# Altium schematic sheet NUCLEO.SchDoc
size A; SheetNumber: 1; SheetTotal: 4
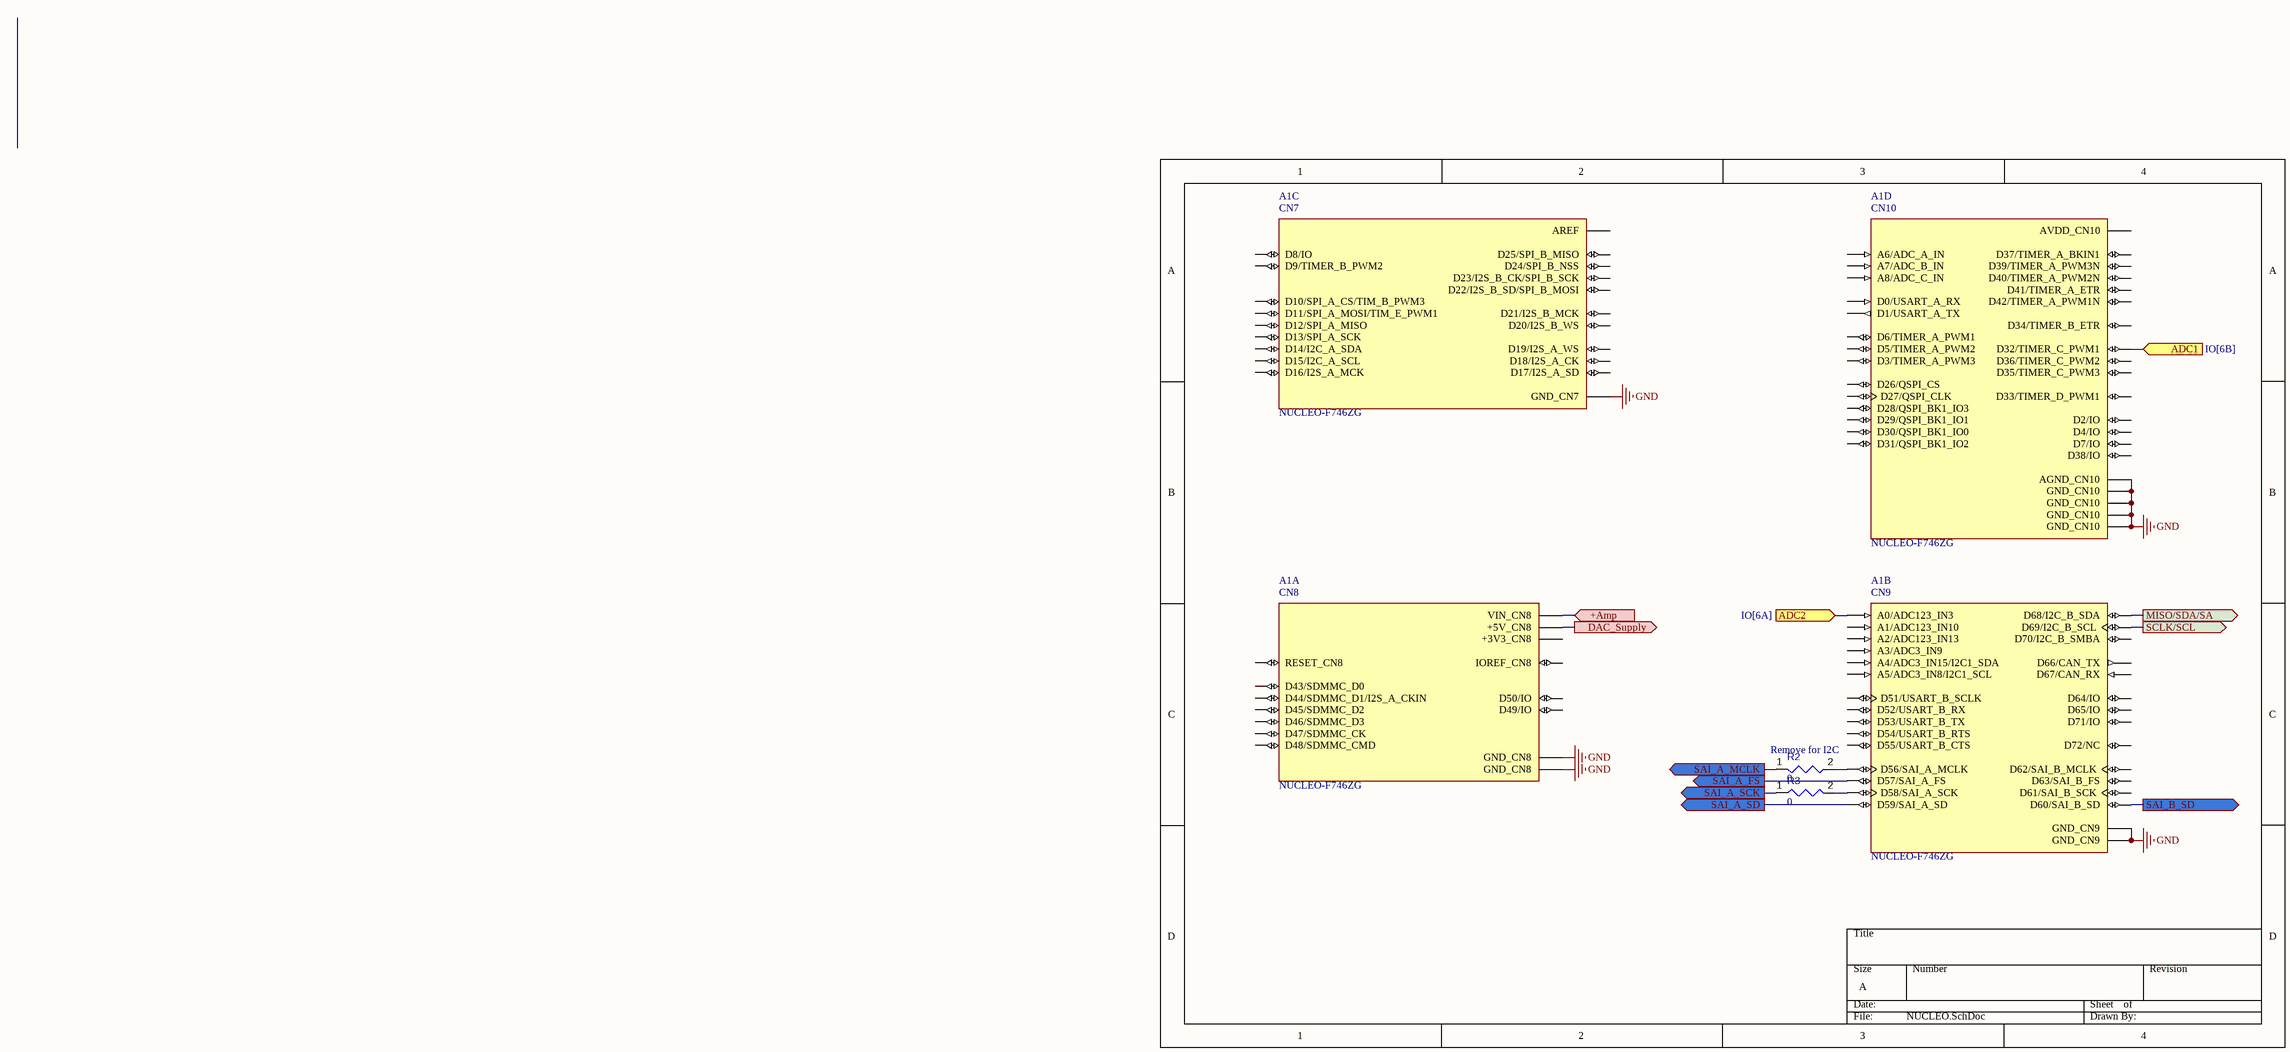
[diagram p0: NUCLEO.SchDoc]

## Parts
A1  NUCLEO-F746ZG  [MODULE_NUCLEO-F746ZG]  (parts A,B,C,D of 4)
R2  value 0  [RESC0603(1608)_L]  (hidden comment: 0Ohm 0603)
R3  0  [RESC0603(1608)_L]

## Ports
+Amp (in, see Amps[1A], Amps[1B], Amps[1C], Amps[1D], Amps[2A], Amps[2B], Amps[2C], Amps[2D], Amps[3A], Amps[3B], Amps[3C], Amps[3D], Amps[4A], Amps[4B], Amps[4C], Amps[4D], Amps[5A], Amps[5B], Amps[5C], Amps[5D], Amps[6A], Amps[6B], Amps[6C], Amps[6D], IO[1B], IO[2B], IO[5A], IO[5B]), ADC1 (in, see IO[6B]), ADC2 (in, see IO[6A]), DAC_Supply (out, see DAC[1D], DAC[4D]), MISO/SDA/SA (out, see DAC[3C], DAC[6C]), SAI_A_FS (out, see DAC[2C], DAC[5C]), SAI_A_MCLK (out, see DAC[1C], DAC[4C]), SAI_A_SCK (out, see DAC[2C], DAC[5C]), SAI_A_SD (out, see DAC[2C]), SAI_B_SD (out, see DAC[5C]), SCLK/SCL (out, see DAC[3C], DAC[6C])

## Nets
GND: A1.CN7_8(GND_CN7) A1.CN8_11(GND_CN8) A1.CN8_13(GND_CN8) A1.CN9_12(GND_CN9) A1.CN9_23(GND_CN9) A1.CN10_3(AGND_CN10) A1.CN10_5(GND_CN10) A1.CN10_17(GND_CN10) A1.CN10_22(GND_CN10) A1.CN10_27(GND_CN10)
+Amp: A1.CN8_15(VIN_CN8) ; port +Amp
ADC1: A1.CN10_29(D32/TIMER_C_PWM1) ; port ADC1
ADC2: A1.CN9_1(A0/ADC123_IN3) ; port ADC2
DAC_Supply: A1.CN8_9(+5V_CN8) ; port DAC_Supply
MISO/SDA/SA: A1.CN9_21(D68/I2C_B_SDA) ; port MISO/SDA/SA
SAI_A_FS: A1.CN9_16(D57/SAI_A_FS) ; port SAI_A_FS
SAI_A_MCLK: R2.1 ; port SAI_A_MCLK
SAI_A_SCK: R3.1 ; port SAI_A_SCK
SAI_A_SD: A1.CN9_20(D59/SAI_A_SD) ; port SAI_A_SD
SAI_B_SD: A1.CN9_22(D60/SAI_B_SD) ; port SAI_B_SD
SCLK/SCL: A1.CN9_19(D69/I2C_B_SCL) ; port SCLK/SCL
NetA1_CN9_14: A1.CN9_14(D56/SAI_A_MCLK) R2.2
NetA1_CN9_18: A1.CN9_18(D58/SAI_A_SCK) R3.2

Not connected (* = marked no-connect by the designer): A1 CN7_1(D16/I2S_A_MCK) CN7_2(D15/I2C_A_SCL) CN7_3(D17/I2S_A_SD) CN7_4(D14/I2C_A_SDA) CN7_5(D18/I2S_A_CK) CN7_6(AREF) CN7_7(D19/I2S_A_WS) CN7_9(D20/I2S_B_WS) CN7_10(D13/SPI_A_SCK) CN7_11(D21/I2S_B_MCK) CN7_12(D12/SPI_A_MISO) CN7_13(D22/I2S_B_SD/SPI_B_MOSI) CN7_14(D11/SPI_A_MOSI/TIM_E_PWM1) CN7_15(D23/I2S_B_CK/SPI_B_SCK) CN7_16(D10/SPI_A_CS/TIM_B_PWM3) CN7_17(D24/SPI_B_NSS) CN7_18(D9/TIMER_B_PWM2) CN7_19(D25/SPI_B_MISO) CN7_20(D8/IO) CN8_2(D43/SDMMC_D0) CN8_3(IOREF_CN8) CN8_4(D44/SDMMC_D1/I2S_A_CKIN) CN8_5(RESET_CN8) CN8_6(D45/SDMMC_D2) CN8_7(+3V3_CN8) CN8_8(D46/SDMMC_D3) CN8_10(D47/SDMMC_CK) CN8_12(D48/SDMMC_CMD) CN8_14(D49/IO) CN8_16(D50/IO) CN9_2(D51/USART_B_SCLK) CN9_3(A1/ADC123_IN10) CN9_4(D52/USART_B_RX) CN9_5(A2/ADC123_IN13) CN9_6(D53/USART_B_TX) CN9_7(A3/ADC3_IN9) CN9_8(D54/USART_B_RTS) CN9_9(A4/ADC3_IN15/I2C1_SDA) CN9_10(D55/USART_B_CTS) CN9_11(A5/ADC3_IN8/I2C1_SCL) CN9_13(D72/NC) CN9_15(D71/IO) CN9_17(D70/I2C_B_SMBA) CN9_24(D61/SAI_B_SCK) CN9_25(D67/CAN_RX) CN9_26(D62/SAI_B_MCLK) CN9_27(D66/CAN_TX) CN9_28(D63/SAI_B_FS) CN9_29(D65/IO) CN9_30(D64/IO) CN10_1(AVDD_CN10) CN10_2(D7/IO) CN10_4(D6/TIMER_A_PWM1) CN10_6(D5/TIMER_A_PWM2) CN10_7(A6/ADC_A_IN) CN10_8(D4/IO) CN10_9(A7/ADC_B_IN) CN10_10(D3/TIMER_A_PWM3) CN10_11(A8/ADC_C_IN) CN10_12(D2/IO) CN10_13(D26/QSPI_CS) CN10_14(D1/USART_A_TX) CN10_15(D27/QSPI_CLK) CN10_16(D0/USART_A_RX) CN10_18(D42/TIMER_A_PWM1N) CN10_19(D28/QSPI_BK1_IO3) CN10_20(D41/TIMER_A_ETR) CN10_21(D29/QSPI_BK1_IO1) CN10_23(D30/QSPI_BK1_IO0) CN10_24(D40/TIMER_A_PWM2N) CN10_25(D31/QSPI_BK1_IO2) CN10_26(D39/TIMER_A_PWM3N) CN10_28(D38/IO) CN10_30(D37/TIMER_A_BKIN1) CN10_31(D33/TIMER_D_PWM1) CN10_32(D36/TIMER_C_PWM2) CN10_33(D34/TIMER_B_ETR) CN10_34(D35/TIMER_C_PWM3)

## Notes on the sheet
- (near R2) Remove for I2C
- (in symbol NUCLEO-F746ZG, part A) CN8
- (in symbol NUCLEO-F746ZG, part B) CN9
- (in symbol NUCLEO-F746ZG, part C) CN7
- (in symbol NUCLEO-F746ZG, part D) CN10

## Library data of the parts
A1 = NUCLEO-F746ZG: STM32F746ZG, mbed-Enabled Development Nucleo-144 STM32F7 ARMÂ® CortexÂ®-M7 MCU 32-Bit Embedded Evaluation Board; MF: STMicroelectronics; SnapEDA_Link: https://www.snapeda.com/parts/NUCLEO-F746ZG/STMicroelectronics/view-part/531935/?ref=snap; Price: None; Check_prices: https://www.snapeda.com/parts/NUCLEO-F746ZG/STMicroelectronics/view-part/531935/?ref=eda; Value: *; Package: None; Availability: Warning; Purchase-URL: https://pricing.snapeda.com/search/part/NUCLEO-F746ZG/?ref=eda; MP: NUCLEO-F746ZG
R2 = CMP-009-00175-3: Pins: 2; Min Operating Temperature: -55°C; Max Operating Temperature: 155°C; Case/Package: 0603
R3 = CMP-009-00175-3: 0ohm 0603; Pins: 2; Min Operating Temperature: -55°C; Max Operating Temperature: 155°C; Case/Package: 0603; Value: 0